# EAGLE design untitled 3 (EAGLE 7.5.0)
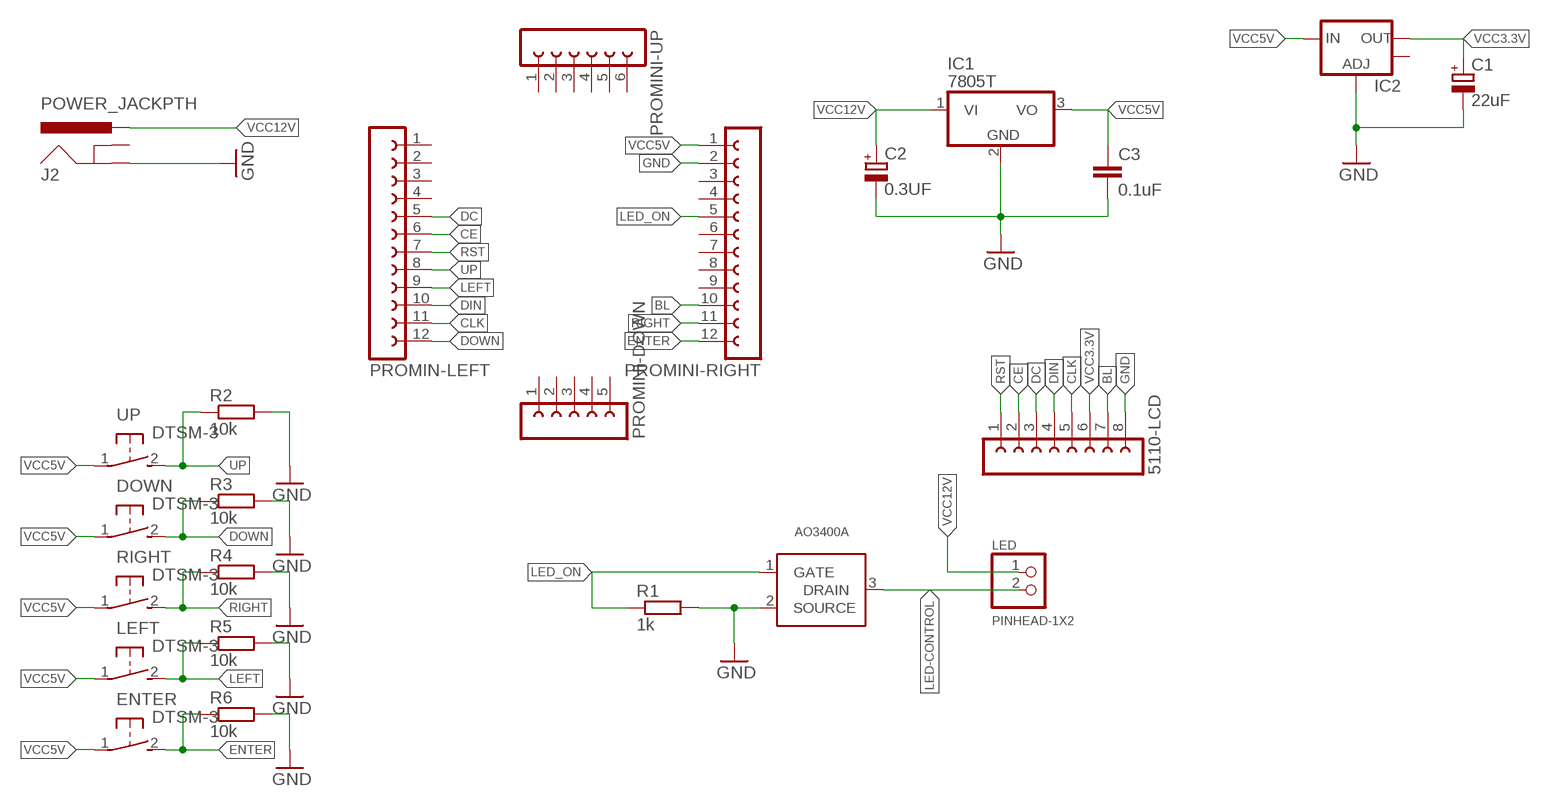
[diagram p0: schematic, sheet 1]

## Parts
5110-LCD  FE08-1  [FE08]
C1  22uF  CPOL-EUE2-5  [E2-5]
C2  0.3UF  CPOL-EUE5-5  [E5-5]
C3  0.1uF  C-EU050-025X075  [C050-025X075]
DOWN  DTSM-3  [DTSM-3]
ENTER  DTSM-3  [DTSM-3]
IC1  7805T  [TO220H]
IC2  V_REG_LM1117SOT223  [SOT223]
J2  POWER_JACKPTH  [POWER_JACK_PTH]
LED  PINHEAD-1X2  [PIHEAD-1X2]
LEFT  DTSM-3  [DTSM-3]
PROMIN-LEFT  FE12-1  [FE12]
PROMINI-DOWN  FE05-1  [FE05-1]
PROMINI-RIGHT  FE12-1  [FE12]
PROMINI-UP  FE06-1  [FE06]
R1  1k  R-EU_R1206  [R1206]
R2  10k  R-EU_R1206  [R1206]
R3  10k  R-EU_R1206  [R1206]
R4  10k  R-EU_R1206  [R1206]
R5  10k  R-EU_R1206  [R1206]
R6  10k  R-EU_R1206  [R1206]
RIGHT  DTSM-3  [DTSM-3]
U$1  AO3400A  [SOT-23]
UP  DTSM-3  [DTSM-3]

## Nets
BL: 5110-LCD.7 PROMINI-RIGHT.10
CE: 5110-LCD.2 PROMIN-LEFT.6
CLK: 5110-LCD.5 PROMIN-LEFT.11
DC: 5110-LCD.3 PROMIN-LEFT.5
DIN: 5110-LCD.4 PROMIN-LEFT.10
DOWN: DOWN.2 PROMIN-LEFT.12 R3.1
ENTER: ENTER.2 PROMINI-RIGHT.12 R6.1
GND: 5110-LCD.8 C1.- C2.- C3.2 IC1.2(GND) IC2.1(ADJ) J2.GND PROMINI-RIGHT.2 R1.2 R2.2 R3.2 R4.2 R5.2 R6.2 U$1.2(SOURCE)
LED-CONTROL: LED.2 U$1.3(DRAIN)
LED_ON: PROMINI-RIGHT.5 R1.1 U$1.1(GATE)
LEFT: LEFT.2 PROMIN-LEFT.9 R5.1
RIGHT: PROMINI-RIGHT.11 R4.1 RIGHT.2
RST: 5110-LCD.1 PROMIN-LEFT.7
UP: PROMIN-LEFT.8 R2.1 UP.2
VCC3.3V: 5110-LCD.6 C1.+ IC2.2(OUT)
VCC5V: C3.1 DOWN.1 ENTER.1 IC1.3(VO) IC2.3(IN) LEFT.1 PROMINI-RIGHT.1 RIGHT.1 UP.1
VCC12V: C2.+ IC1.1(VI) J2.PWR LED.1
Unconnected: IC2.4(OUT) J2.GNDBREAK PROMIN-LEFT.1 PROMIN-LEFT.2 PROMIN-LEFT.3 PROMIN-LEFT.4 PROMINI-DOWN.1 PROMINI-DOWN.2 PROMINI-DOWN.3 PROMINI-DOWN.4 PROMINI-DOWN.5 PROMINI-RIGHT.3 PROMINI-RIGHT.4 PROMINI-RIGHT.6 PROMINI-RIGHT.7 PROMINI-RIGHT.8 PROMINI-RIGHT.9 PROMINI-UP.1 PROMINI-UP.2 PROMINI-UP.3 PROMINI-UP.4 PROMINI-UP.5 PROMINI-UP.6

## Library data of the parts
5110-LCD = con-lsta:FE08-1: FEMALE HEADER; OC_FARNELL: unknown; OC_NEWARK: unknown
C1 C2 = resistor:CPOL-EU: POLARIZED CAPACITOR, European symbol
C3 = resistor:C-EU: CAPACITOR, European symbol
DOWN ENTER LEFT RIGHT UP = switch-tact:DTSM-3
IC1 = linear:78*: Positive VOLTAGE REGULATOR Source: http://cache.national.com/ds/LM/LM78L05.pdf http://www.fairchildsemi.com/ds/LM/LM7805.pdf
IC2 = SparkFun-PowerIC:V_REG_LM1117: Voltage Regulator LM1117 Standard adjustable voltage regulator but in SMD form. Spark Fun Electronics SKU : COM-00595; PROD_ID: VREG-08170
J2 = SparkFun-Connectors:POWER_JACK: Power Jack This is the standard 5.5mm barrel jack for power. The PTH is the most common, proven, reliable, footprint. The Slot footprint only works if the mill layer is transmitted to the PCB fab house so be warned. Mating wall wart : TOL-00298 (and others); PROD_ID: CONN-08197
LED = mcp73831:PINHEAD-1X2
PROMIN-LEFT PROMINI-RIGHT = con-lsta:FE12-1: FEMALE HEADER; OC_FARNELL: unknown; OC_NEWARK: unknown
PROMINI-DOWN = con-lsta:FE05-1: FEMALE HEADER; OC_FARNELL: unknown; OC_NEWARK: unknown
PROMINI-UP = con-lsta:FE06-1: FEMALE HEADER; OC_FARNELL: unknown; OC_NEWARK: unknown
R1-R6 = resistor:R-EU_: RESISTOR, European symbol
U$1 = smd-footprints:AO3400A

## Board
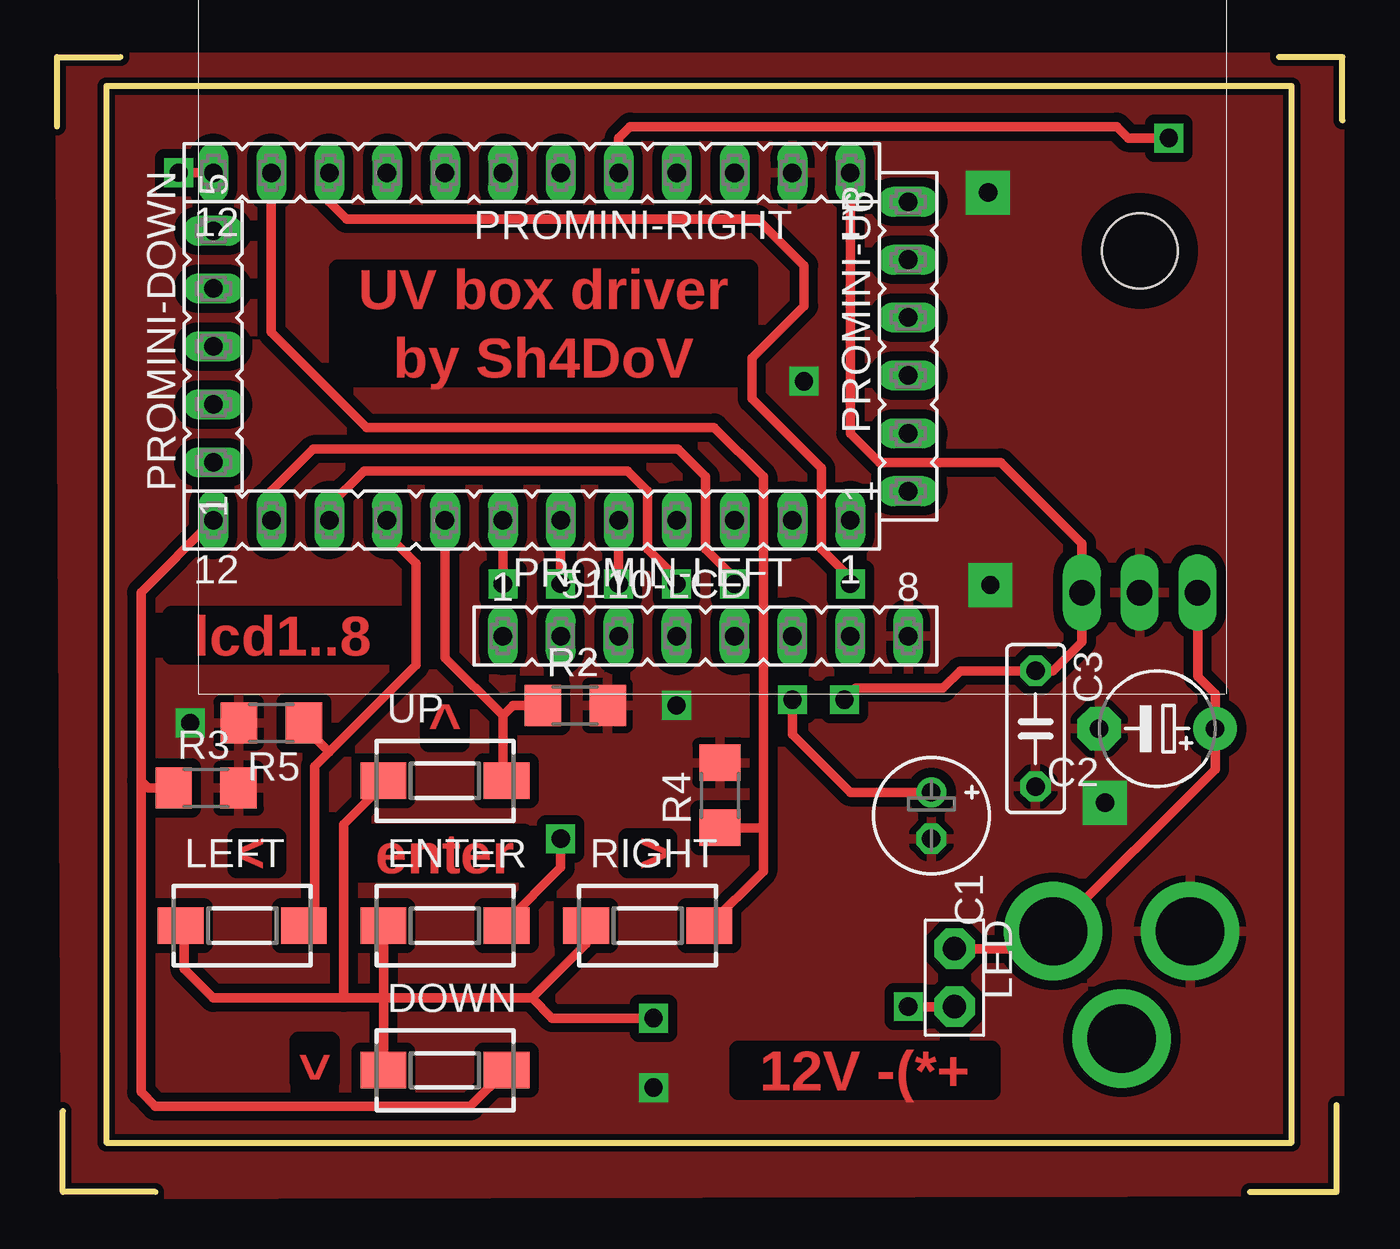
[diagram p1: board, top side]
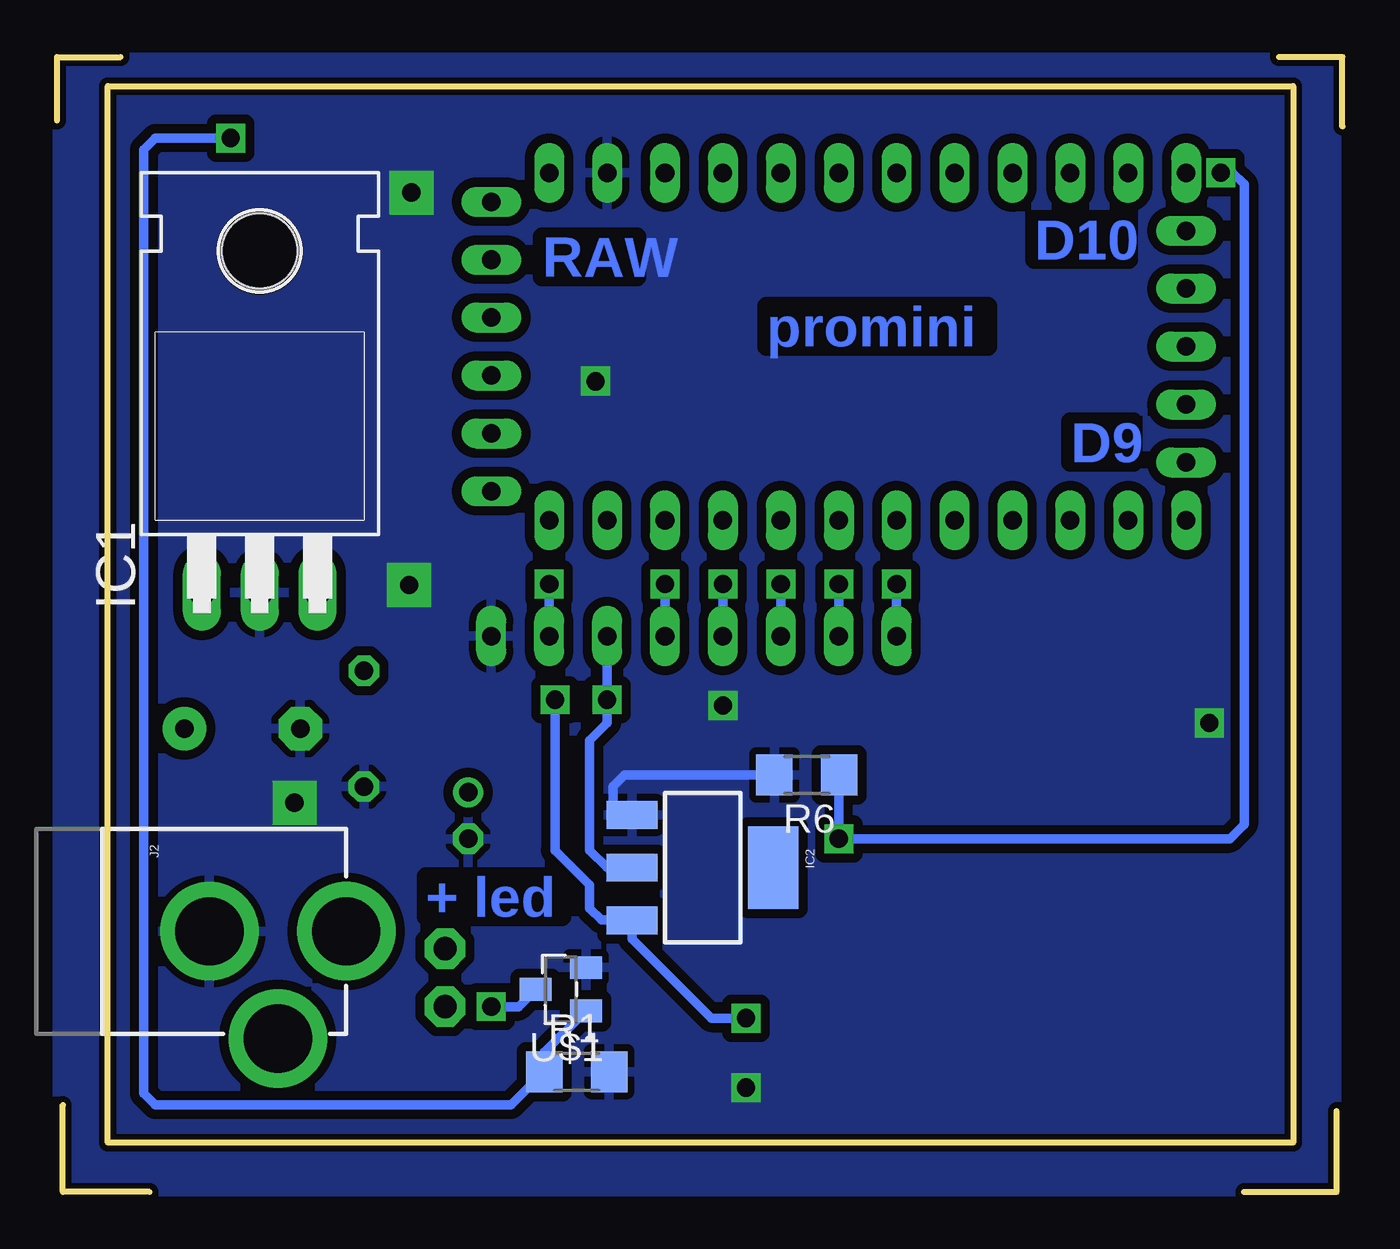
[diagram p2: board, bottom side, seen from below]

Size 56.39 x 49.78 mm. Coordinates in mm from the lower left corner, seen from the top.
Outline: 0,46.74 0,49.78 2.79,49.78
Outline: 56.39,46.99 56.39,49.78 53.59,49.78
Outline: 52.32,0 56.13,0 56.13,3.81
Outline: 4.32,0 0.25,0 0.25,3.56
Outline: 2.16,2.16 54.15,2.16 54.15,48.5 2.16,48.5 2.16,2.16
Copper layers (1*16): Top 0.035mm / dielectric 1.5mm / Bottom 0.035mm
Design rules "default 16mils": minimum track width 10mil, minimum drill 24mil, track to track 16mil, track to pad 16mil, pad to pad 16mil, via to via 16mil, smd to smd 10mil, copper to edge 10mil, drill to drill 10mil, minimum pad ring 10mil, minimum via ring 8mil, stop-mask expansion 4mil, vias tented up to drill 0mil, thermal gap 12mil
tRestrict: area 30.3,5.2 to 30.7,5.6

### Footprints (pad centres in the part's own frame; a part is rotated, then mirrored left to right if it is on the bottom)
FE08 = drill 0.813 long: 1 -8.89,0; 2 -6.35,0; 3 -3.81,0; 4 -1.27,0; 5 1.27,0; 6 3.81,0; 7 6.35,0; 8 8.89,0
E2-5 = drill 0.813 pad 1.27: + -1.016,0 | drill 0.813 pad 1.27 octagon: - 1.016,0
E5-5 = drill 0.813 pad 1.905: + -2.54,0 | drill 0.813 pad 1.905 octagon: - 2.54,0
C050-025X075 = drill 0.813 octagon: 1 -2.54,0; 2 2.54,0
DTSM-3 = smd 2 x 1.6: 1 -2.7,0; 2 2.7,0
TO220H = drill 1.118 long: 1 -2.54,-10.16; 2 0,-10.16; 3 2.54,-10.16 | hole 3.302: 0,4.826
SOT223 = smd 1.219 x 2.235: 1 -2.311,-3.099; 2 0,-3.099; 3 2.311,-3.099 | smd 3.6 x 2.2: 4 0,3.099
POWER_JACK_PTH = drill 2.997 pad 4.318: GND 0,7.7; GNDBREAK 4.7,10.7; PWR 0,13.7
PIHEAD-1X2 = drill 1.016 pad 1.778 octagon: 1 -1.27,0; 2 1.27,0
FE12 = drill 0.813 long: 1 -13.97,0; 2 -11.43,0; 3 -8.89,0; 4 -6.35,0; 5 -3.81,0; 6 -1.27,0; 7 1.27,0; 8 3.81,0; 9 6.35,0; 10 8.89,0; 11 11.43,0; 12 13.97,0
FE05-1 = drill 0.813 long: 1 -5.08,0; 2 -2.54,0; 3 0,0; 4 2.54,0; 5 5.08,0
FE06 = drill 0.813 long: 1 -6.35,0; 2 -3.81,0; 3 -1.27,0; 4 1.27,0; 5 3.81,0; 6 6.35,0
R1206 = smd 1.6 x 1.803: 1 -1.422,0; 2 1.422,0
SOT-23 = smd 1 x 1.4: 1 -0.95,-1.1; 2 0.95,-1.1; 3 0,1.1

### Placement (x,y rotation side)
5110-LCD  28.45,24.38 0 top
C1  38.35,16.51 270 top
C2  48.26,20.32 180 top
C3  42.93,20.32 270 top
DOWN  17.02,5.33 0 top
ENTER  17.02,11.68 0 top
IC1  47.5,36.45 0 bottom
IC2  28.07,14.22 270 bottom
J2  57.4,11.43 270 bottom
LED  39.37,9.4 270 top
LEFT  8.13,11.68 0 top
PROMIN-LEFT  20.83,29.46 180 top
PROMINI-DOWN  6.86,37.08 90 top
PROMINI-RIGHT  20.83,44.7 180 top
PROMINI-UP  37.34,37.08 90 top
R1  33.59,5.27 0 bottom
R2  22.73,21.34 0 top
R3  6.54,17.72 0 top
R4  29.08,17.4 90 top
R5  9.4,20.57 180 top
R6  23.49,18.29 180 bottom
RIGHT  25.91,11.68 0 top
U$1  34.29,8.89 90 bottom
UP  17.02,18.03 0 top

### Tracks (layer width: path | path; a pad name or v marks a point on that pad's centre or on a via)
BL  (via drill 0.8 pad 1.27)
  Top 0.406: PROMINI-RIGHT.10 11.94,43.43 12.7,42.67 30.73,42.67 32.77,40.64 32.77,38.86 30.48,36.58 30.48,34.8 33.53,31.75 33.53,28.19 34.8,26.92 v34.8,26.67
  Bottom 0.406: 5110-LCD.7 v34.8,26.67
CE  (via drill 0.8 pad 1.27)
  Top 0.406: v22.1,26.67 PROMIN-LEFT.6
  Bottom 0.406: 5110-LCD.2 v22.1,26.67
CLK  (via drill 0.8 pad 1.27)
  Top 0.406: PROMIN-LEFT.11 9.4,30.73 11.24,32.58 27.24,32.58 28.45,31.37 28.45,28.19 29.72,26.92 v29.72,26.67
  Bottom 0.406: 5110-LCD.5 v29.72,26.67
DC  (via drill 0.8 pad 1.27)
  Top 0.406: v24.64,26.67 PROMIN-LEFT.5
  Bottom 0.406: 5110-LCD.3 v24.64,26.67
DIN  (via drill 0.8 pad 1.27)
  Top 0.406: PROMIN-LEFT.10 11.94,30.1 13.46,31.62 25.02,31.62 25.91,30.73 25.91,28.19 27.18,26.92 v27.18,26.67
  Bottom 0.406: 5110-LCD.4 v27.18,26.67
DOWN
  Top 0.406: PROMIN-LEFT.12 3.68,26.29 3.68,18.03 | 3.68,18.03 3.68,4.38 4.32,3.75 18.13,3.75 DOWN.2 | R3.1 4,17.72 3.68,18.03
ENTER  (via drill 0.8 pad 1.27)
  Top 0.406: ENTER.2 19.72,11.84 22.1,14.22 v22.1,15.49 | PROMINI-RIGHT.12 v5.33,44.7
  Bottom 0.406: R6.1 22.1,17.55 v22.1,15.49 4.95,15.49 4.32,16.13 4.32,44.2 4.83,44.7 v5.33,44.7
GND  (via drill 0.8 pad 1.27, 0.8 pad 1.93)
  Bottom 0.406: R6.2 31.5,18.29 32,17.78 32,16.71 IC2.1
  other vias: 45.97,17.07 40.94,26.62 40.84,43.84 27.18,21.34 5.84,20.57 26.16,4.57 32.77,35.56
  pour Top: 2.26,48.77 54.05,48.36 54.46,1.55 1.85,1.55
  pour Bottom: 54.13,48.41 2.01,48.82 1.78,2.16 54.48,2.16
LED-CONTROL  (via drill 0.8 pad 1.27)
  Top 0.406: LED.2 v37.34,8.13
  Bottom 0.406: v37.34,8.13 36.15,8.13 U$1.3
LED_ON  (via drill 0.8 pad 1.27)
  Top 0.406: PROMINI-RIGHT.5 24.64,46.23 25.15,46.74 46.48,46.74 46.99,46.23 v48.77,46.23
  Bottom 0.406: U$1.1 35.01,6.12 R1.1 36.47,3.81 52.07,3.81 52.58,4.32 52.58,45.72 52.07,46.23 v48.77,46.23
LEFT
  Top 0.406: 11.94,19.3 15.75,23.11 15.75,27.56 14.48,28.83 PROMIN-LEFT.9 | 11.94,19.3 11.3,18.67 11.3,12.16 LEFT.2 | R5.1 10.82,20.42 11.94,19.3
N$1
  pour Top: 0.13,49.78 56.26,49.78 56.26,0 0.38,-0.13
N$2
  pour Bottom: 0.25,0 56.39,0 56.39,49.78 0.25,49.78
RIGHT
  Top 0.406: PROMINI-RIGHT.11 9.4,37.72 13.59,33.53 28.83,33.53 30.99,31.37 30.99,16.13 | 30.99,16.13 30.99,14.06 RIGHT.2 | R4.1 30.84,15.98 30.99,16.13
RST  (via drill 0.8 pad 1.27)
  Top 0.406: v19.56,26.67 PROMIN-LEFT.7
  Bottom 0.406: 5110-LCD.1 v19.56,26.67
UP
  Top 0.406: PROMIN-LEFT.8 17.02,23.43 19.56,20.89 | 19.56,20.89 19.56,18.19 UP.2 | R2.1 20,21.34 19.56,20.89
VCC3.3V  (via drill 0.8 pad 1.27)
  Top 0.406: v32.26,21.59 32.26,20.07 34.8,17.53 C1.+
  Bottom 0.406: 5110-LCD.6 v32.26,21.59 32.26,20.57 33.02,19.81 33.02,14.99 32.26,14.22 IC2.2
VCC5V  (via drill 0.8 pad 1.27)
  Top 0.406: RIGHT.1 23.21,10.89 20.83,8.51 | 20.83,8.51 14.48,8.51 | 14.48,8.51 12.57,8.51 | 12.57,8.51 6.86,8.51 5.59,9.78 5.59,11.52 LEFT.1 | ENTER.1 14.32,8.67 14.48,8.51 | UP.1 14.32,17.87 12.57,16.13 12.57,8.51 | DOWN.1 14.32,8.35 14.48,8.51 | PROMINI-RIGHT.1 34.8,33.27 36.07,32 41.4,32 44.96,28.45 IC1.3 44.96,24.13 43.69,22.86 C3.1 39.62,22.86 38.86,22.1 35.05,22.1 v34.54,21.59 | v26.16,7.62 21.72,7.62 20.83,8.51
  Bottom 0.406: v34.54,21.59 34.54,14.99 33.02,13.46 33.02,12.45 32.51,11.94 31.19,11.94 IC2.3 31.17,11.1 27.69,7.62 v26.16,7.62
VCC12V
  Top 0.406: LED.1 42.94,10.67 J2.PWR 43.7,11.45 50.8,18.54 C2.+ 50.8,21.84 50.04,22.61 IC1.1

### Text on the board
Top: UV box driver / by Sh4DoV | lcd1..8 | ^ | ^ | enter | ^ | ^ | 12V -(*+
Bottom: D10 | RAW | promini | D9 | led | +